# Altium schematic sheet PROC051C_PWR_In_Reference.SchDoc
size 431 x 279 mm; Date: Not shown in title block; ApprovedBy: Not shown in title block; CheckedBy: Not shown in title block; Author: Not shown in title block; CompanyName: Not shown in title block; Engineer: Not shown in title block; Organization: Not shown in title block; Address1: Not shown in title block; Address2: Not shown in title block; Address3: Not shown in title block; Address4: Not shown in title block; DocumentNumber: 4; Revision: Use project parameter SCH_Rev; SheetNumber: 4; SheetTotal: 16; PageSetup: Record=PageOptions|CenterHorizontal=True|CenterVertical=True|PrintScale=1.00|XCorrection=1.00|YCorrection=1.00|PrintKind=0|BorderSize=5000000|LeftOffset=0|BottomOffset=0|Orientation=2|PaperLength=1000|PaperWidth=1000|Scale=100|PaperSource=15|PrintQuality=600|MediaType=1|DitherType=10|PaperKind=Letter|PrintScaleMode=1; CurrentTime: Not shown in title block; CurrentDate: Not shown in title block; Time: Not shown in title block; DocumentFullPathAndName: Not shown in title block; DocumentName: Not shown in title block; ModifiedDate: Not shown in title block; ImagePath: Not shown in title block
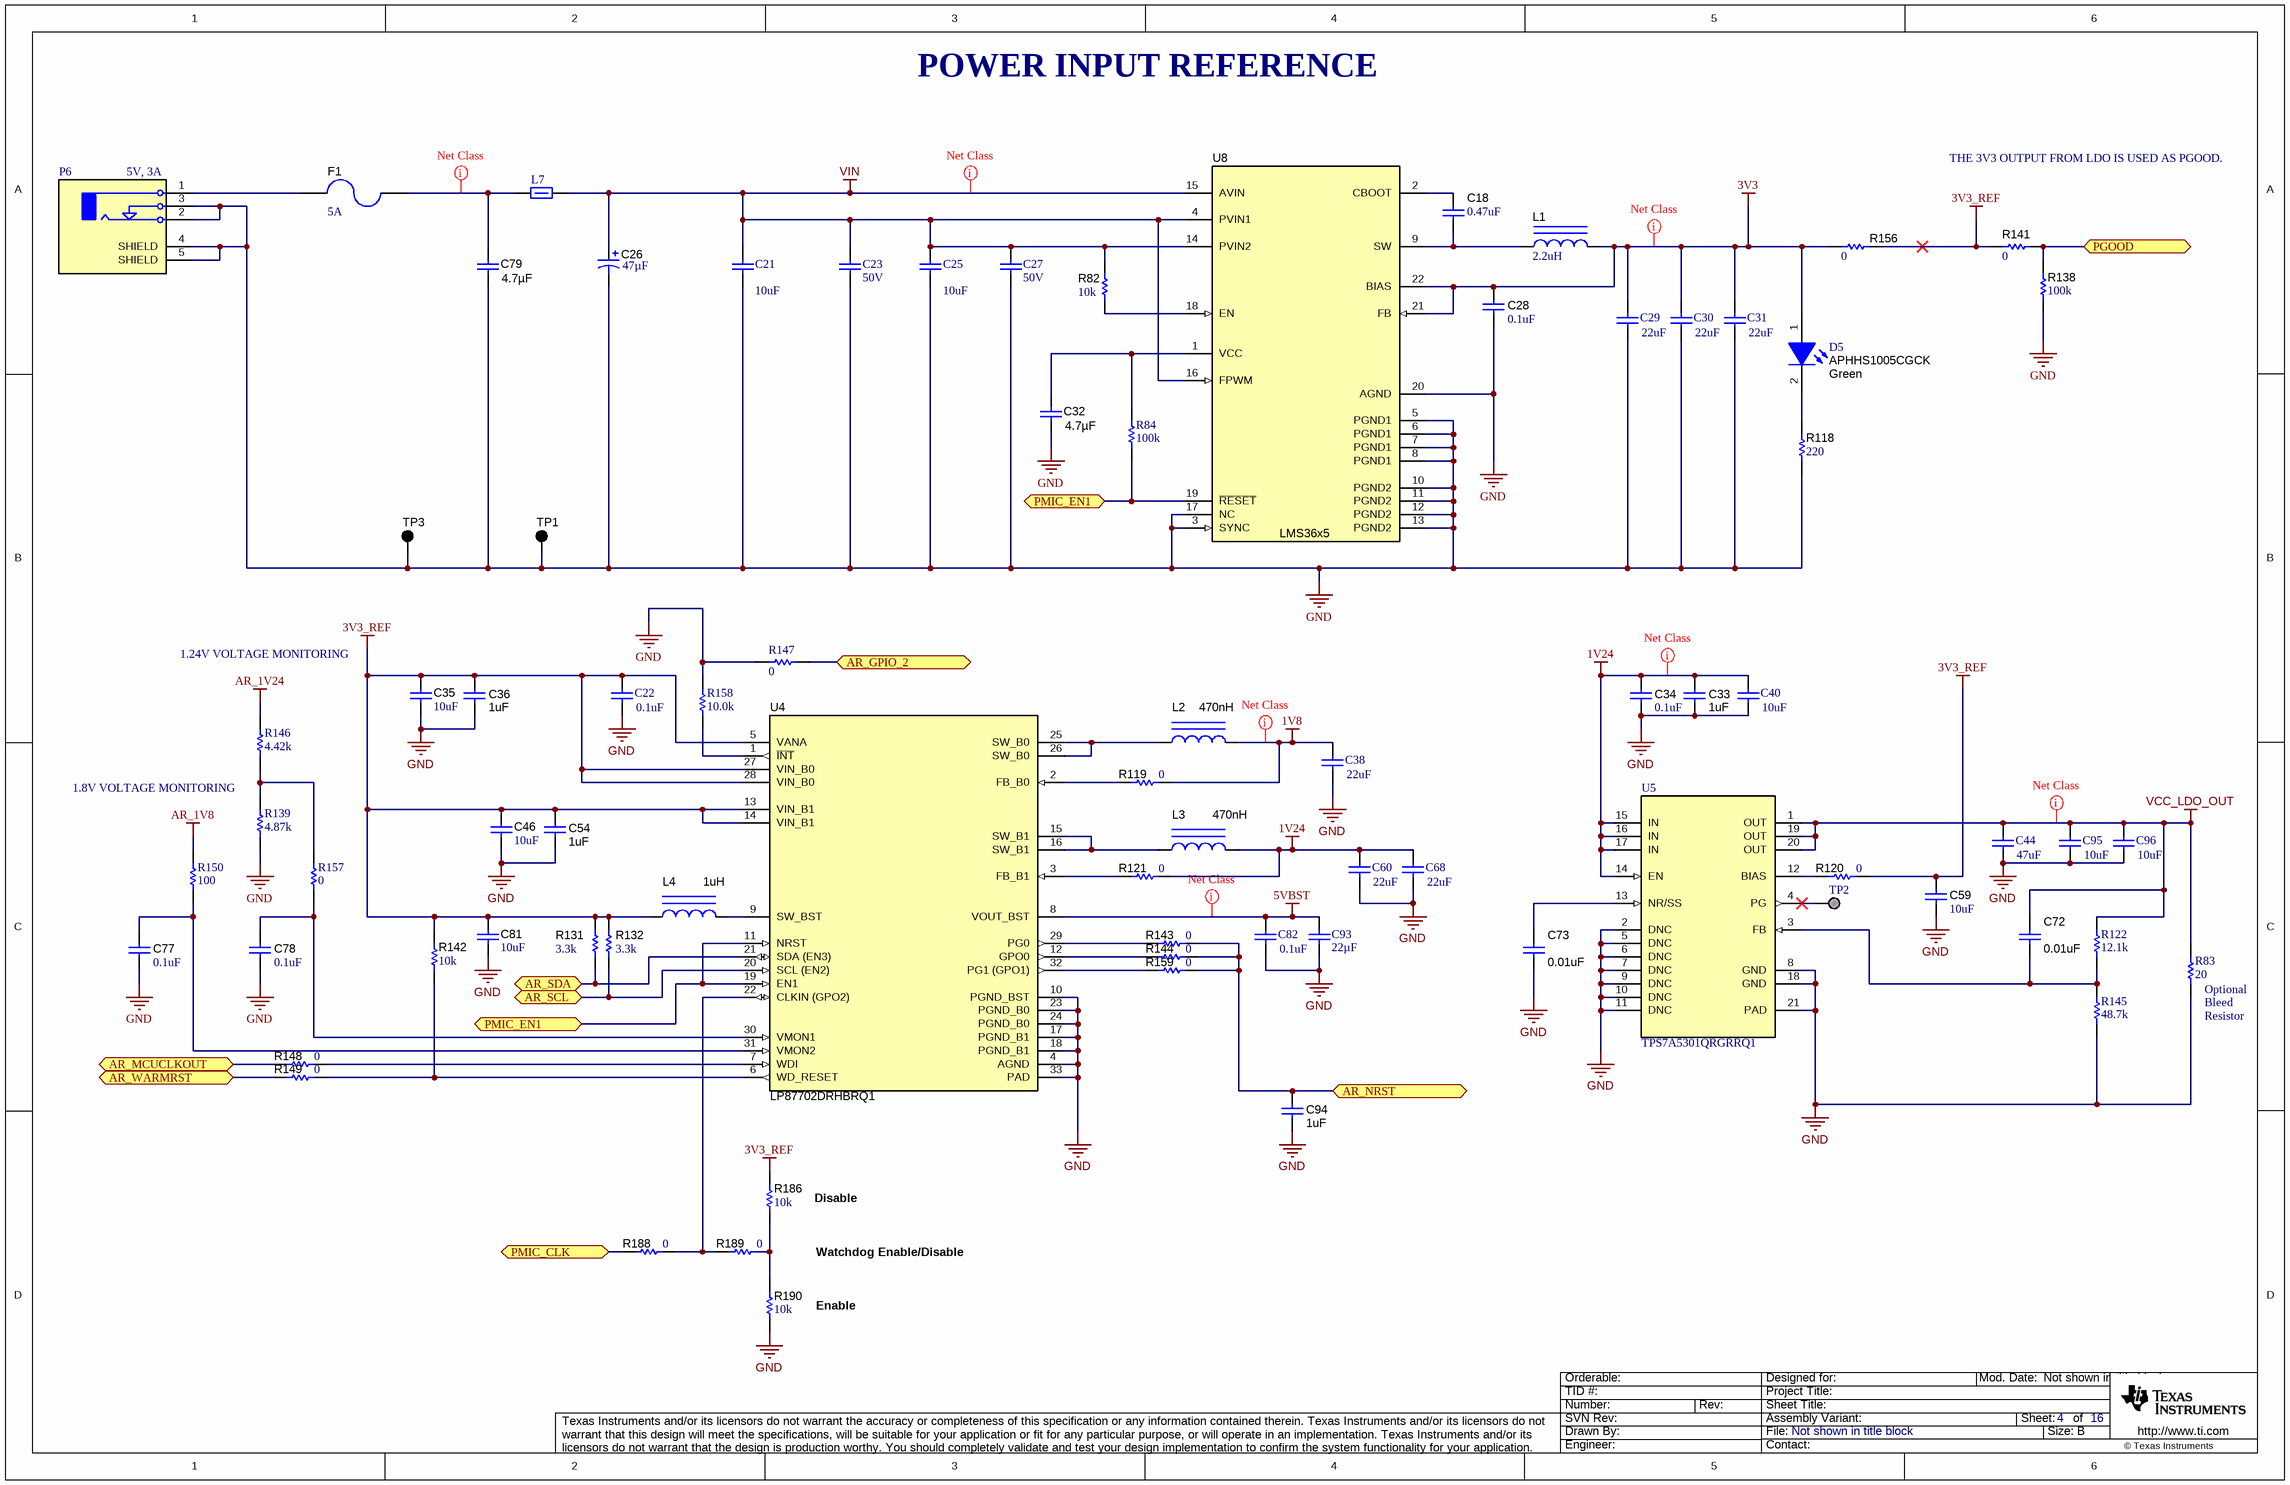
[diagram p0: PROC051C_PWR_In_Reference.SchDoc]

## Parts
C18  ValueDisplayed: 0.47uF  [0402S]  (hidden comment: Capacitor)
C21  ValueDisplayed: 10uF  [1210_280]  (hidden comment: CGA6P1X7R1E106M250AC)
C22  ValueDisplayed: 0.1uF  [0402]  (hidden comment: GCM155R71C104KA55D)
C23  VDC_V: 50V  [0603]  (hidden comment: 06035C473JAT2A)
C25  ValueDisplayed: 10uF  [1210_280]  (hidden comment: CGA6P1X7R1E106M250AC)
C26  ValueDisplayed: 47µF  [3528-21]  (hidden comment: T491B476K010AT)
C27  VDC_V: 50V  [0603]  (hidden comment: 06035C473JAT2A)
C28  ValueDisplayed: 0.1uF  [0402S]  (hidden comment: Capacitor)
C29  ValueDisplayed: 22uF  [1210_280]  (hidden comment: GCM32ER71C226KE19L)
C30  ValueDisplayed: 22uF  [1210_280]  (hidden comment: GCM32ER71C226KE19L)
C31  ValueDisplayed: 22uF  [1210_280]  (hidden comment: GCM32ER71C226KE19L)
C32  ValueDisplayed: 4.7µF  [0805L]  (hidden comment: CGA4J1X7R1E475K125AC)
C33  ValueDisplayed: 1uF  [0603]  (hidden comment: GCM188R71C105KA64D)
C34  ValueDisplayed: 0.1uF  [0402]  (hidden comment: Capacitor)
C35  ValueDisplayed: 10uF  [0805_HV1]  (hidden comment: Capacitor)
C36  ValueDisplayed: 1uF  [0603]  (hidden comment: GCM188R71C105KA64D)
C38  ValueDisplayed: 22uF  [1206_180]  (hidden comment: GCM31CR70J226KE23L)
C40  ValueDisplayed: 10uF  [0805_HV]  (hidden comment: GCM21BR71A106KE22L)
C44  ValueDisplayed: 47uF  [1210_270]  (hidden comment: GCM32ER70J476KE19L)
C46  ValueDisplayed: 10uF  [0805_HV1]  (hidden comment: Capacitor)
C54  ValueDisplayed: 1uF  [0603]  (hidden comment: GCM188R71C105KA64D)
C59  ValueDisplayed: 10uF  [0805_HV]  (hidden comment: Capacitor)
C60  ValueDisplayed: 22uF  [1206_180]  (hidden comment: GCM31CR70J226KE23L)
C68  ValueDisplayed: 22uF  [1206_180]  (hidden comment: GCM31CR70J226KE23L)
C72  ValueDisplayed: 0.01uF  [0402S]  (hidden comment: GCM155R71E103KA37D)
C73  ValueDisplayed: 0.01uF  [0402S]  (hidden comment: GCM155R71E103KA37D)
C77  ValueDisplayed: 0.1uF  [0402]  (hidden comment: Capacitor)
C78  ValueDisplayed: 0.1uF  [0402]  (hidden comment: Capacitor)
C79  ValueDisplayed: 4.7µF  [0805L]  (hidden comment: CGA4J1X7R1E475K125AC)
C81  ValueDisplayed: 10uF  [0805_HV1]  (hidden comment: Capacitor)
C82  ValueDisplayed: 0.1uF  [0402]  (hidden comment: 0402YC104KAT2A)
C93  ValueDisplayed: 22µF  [0805_HV]  (hidden comment: GRT21BR61E226ME13L)
C94  ValueDisplayed: 1uF  [0603]  (hidden comment: GCM188R71C105KA64D)
C95  ValueDisplayed: 10uF  [0805_HV]  (hidden comment: GCM21BR71A106KE22L)
C96  ValueDisplayed: 10uF  [0805_HV]  (hidden comment: GCM21BR71A106KE22L)
D5  APHHS1005CGCK  value Green  [APHHS1005_Green]
F1  0440005.WR  [1206]  (value not drawn)
L1  ValueDisplayed: 2.2uH  [XAL5030]  (hidden comment: XAL5030-222MEB)
L2  ValueDisplayed: 470nH  [DFE252012P]  (hidden comment: DFE252012PD-R47M)
L3  ValueDisplayed: 470nH  [DFE252012P]  (hidden comment: DFE252012PD-R47M)
L4  ValueDisplayed: 1uH  [DFE252012P]  (hidden comment: DFE252012PD-1R0M)
L7  HI2220P601R-10  [2220_345]  (value not drawn)
P6  PJ-051AH  [CUI_PJ-051AH]  (value not drawn)
R82  value 10k  [0402L]  (hidden comment: Resistor)
R83  ValueDisplayed: 20  [0603]  (hidden comment: CRCW060320R0JNEA)
R84  ValueDisplayed: 100k  [0402]  (hidden comment: CRCW0402100KJNED)
R118  ValueDisplayed: 220  [0402]  (hidden comment: CRCW0402220RJNED)
R119  value 0  [0402L]  (hidden comment: Resistor)
R120  value 0  [0402L]  (hidden comment: Resistor)
R121  value 0  [0402L]  (hidden comment: Resistor)
R122  ValueDisplayed: 12.1k  [0402]  (hidden comment: ERA-2AEB1212X)
R131  ValueDisplayed: 3.3k  [0402S]  (hidden comment: Resistor)
R132  ValueDisplayed: 3.3k  [0402S]  (hidden comment: Resistor)
R138  ValueDisplayed: 100k  [0402L]  (hidden comment: CRCW0402100KFKED)
R139  ValueDisplayed: 4.87k  [0402]  (hidden comment: ERA-2AEB4871X)
R141  ValueDisplayed: 0  [0402L]  (hidden comment: ERJ-2GE0R00X)
R142  ValueDisplayed: 10k  [0402]  (hidden comment: CRCW040210K0JNED)
R143  value 0  [0402L]  (hidden comment: Resistor)
R144  value 0  [0402L]  (hidden comment: Resistor)
R145  ValueDisplayed: 48.7k  [0402]  (hidden comment: ERA-2AEB4872X)
R146  ValueDisplayed: 4.42k  [0402]  (hidden comment: ERA-2ARB4421X)
R147  ValueDisplayed: 0  [0402]  (hidden comment: CRCW04020000Z0ED)
R148  value 0  [0402L]  (hidden comment: Resistor)
R149  value 0  [0402L]  (hidden comment: Resistor)
R150  ValueDisplayed: 100  [0402]  (hidden comment: CRCW0402100RFKED)
R156  ValueDisplayed: 0  [2010]  (hidden comment: CRCW20100000Z0EF)
R157  ValueDisplayed: 0  [0402]  (hidden comment: CRCW04020000Z0ED)
R158  ValueDisplayed: 10.0k  [0402]  (hidden comment: CRCW040210K0FKED)
R159  value 0  [0402L]  (hidden comment: Resistor)
R186  ValueDisplayed: 10k  [0402]  (hidden comment: CRCW040210K0JNED)
R188  value 0  [0402L]  (hidden comment: Resistor)
R189  value 0  [0402L]  (hidden comment: Resistor)
R190  ValueDisplayed: 10k  [0402]  (hidden comment: CRCW040210K0JNED)
TP1  5001  [Keystone5001]  (value not drawn)
TP2  TP_H0.45P0.75  [TP_H045P075]  (value not drawn)  (no BOM)
TP3  5001  [Keystone5001]  (value not drawn)
U4  LP87702DRHBRQ1  [RHB0032N]
U5  TPS7A5301QRGRRQ1  [RGR0020A]
U8  LMS36x5  [RNL0022A_NV]

## Ports
AR_GPIO_2, AR_MCUCLKOUT, AR_NRST, AR_SCL, AR_SDA, AR_WARMRST, PGOOD, PMIC_CLK, PMIC_EN1

## Nets
1V8: C38.1 L2.2 R119.1
1V24: C33.2 C34.1 C40.1 C60.1 C68.1 L3.2 R121.1 U5.14(EN) U5.15(IN) U5.16(IN) U5.17(IN)
3V3: C28.1 C29.1 C30.1 C31.1 D5.1(A) L1.2 R156.1 U8.21(FB) U8.22(BIAS)
3V3_REF: C22.1 C35.1 C36.2 C46.1 C54.2 C59.1 C81.1 L4.1 R120.1 R131.2 R132.2 R141.1 R142.2 R156.2 R186.2 U4.5(VANA) U4.13(VIN_B1) U4.14(VIN_B1) U4.27(VIN_B0) U4.28(VIN_B0)
5VBST: C82.1 C93.1 U4.8(VOUT_BST)
AR_1V8: R150.2
AR_1V24: R146.2
GND: C21.2 C22.2 C23.2 C25.2 C26.2(-) C27.2 C28.2 C29.2 C30.2 C31.2 C32.2 C33.1 C34.2 C35.2 C36.1 C38.2 C40.2 C44.2 C46.2 C54.1 C59.2 C60.2 C68.2 C73.2 C77.2 C78.2 C79.2 C81.2 C82.2 C93.2 C94.1 C95.2 C96.2 P6.2(TIP) P6.3(TIP_SWITCH) P6.4(SHIELD) P6.5(SHIELD) R83.1 R118.1 R138.1 R139.1 R145.1 R147.2 R158.2 R190.1 TP1.1 TP3.1 U4.4(AGND) U4.10(PGND_BST) U4.17(PGND_B1) U4.18(PGND_B1) U4.23(PGND_B0) U4.24(PGND_B0) U4.33(PAD) U5.2(DNC) U5.5(DNC) U5.6(DNC) U5.7(DNC) U5.8(GND) U5.9(DNC) U5.10(DNC) U5.11(DNC) U5.18(GND) U5.21(PAD) U8.3(SYNC) U8.5(PGND1) U8.6(PGND1) U8.7(PGND1) U8.8(PGND1) U8.10(PGND2) U8.11(PGND2) U8.12(PGND2) U8.13(PGND2) U8.17(NC) U8.20(AGND)
VCC_LDO_OUT: C44.1 C72.1 C95.1 C96.1 R83.2 R122.2 U5.1(OUT) U5.19(OUT) U5.20(OUT)
VIN: C21.1 C23.1 C25.1 C26.1(+) C27.1 L7.2 R82.1 U8.4(PVIN1) U8.14(PVIN2) U8.15(AVIN) U8.16(FPWM)
AR_GPIO_2: R147.1 ; port AR_GPIO_2
AR_MCUCLKOUT: R148.2 ; port AR_MCUCLKOUT
AR_NRST: C94.2 R143.1 R144.1 R159.1 ; port AR_NRST
AR_SCL: R132.1 U4.20(SCL_(EN2)) ; port AR_SCL
AR_SDA: R131.1 U4.21(SDA_(EN3)) ; port AR_SDA
AR_WARMRST: R149.2 ; port AR_WARMRST
PGOOD: R138.2 R141.2 ; port PGOOD
PMIC_CLK: R188.2 ; port PMIC_CLK
PMIC_EN1: R84.1 U4.11(NRST) U4.19(EN1) U8.19(~{RESET}) ; port PMIC_EN1
NetC18_1: C18.1 U8.2(CBOOT)
NetC18_2: C18.2 L1.1 U8.9(SW)
NetC32_1: C32.1 R84.2 U8.1(VCC)
NetC72_2: C72.2 R122.1 R145.2 U5.3(FB)
NetC73_1: C73.1 U5.13(NR/SS)
NetC77_1: C77.1 R150.1 U4.31(VMON2)
NetC78_1: C78.1 R157.1 U4.30(VMON1)
NetC79_1: C79.1 F1.1 L7.1
NetD5_2: D5.2(K) R118.2
NetF1_2: F1.2 P6.1(SLEEVE)
NetL2_1: L2.1 U4.25(SW_B0) U4.26(SW_B0)
NetL3_1: L3.1 U4.15(SW_B1) U4.16(SW_B1)
NetL4_2: L4.2 U4.9(SW_BST)
NetR82_2: R82.2 U8.18(EN)
NetR119_2: R119.2 U4.2(FB_B0)
NetR120_2: R120.2 U5.12(BIAS)
NetR121_2: R121.2 U4.3(FB_B1)
NetR139_2: R139.2 R146.1 R157.2
NetR142_1: R142.1 R149.1 U4.6(WD_RESET)
NetR143_2: R143.2 U4.29(PG0)
NetR144_2: R144.2 U4.12(GPO0)
NetR148_1: R148.1 U4.7(WDI)
NetR158_1: R158.1 U4.1(~{INT})
NetR159_2: R159.2 U4.32(PG1_(GPO1))
NetR186_1: R186.1 R189.1 R190.2
NetR188_1: R188.1 R189.2 U4.22(CLKIN_(GPO2))
NetTP2_1: TP2.1 U5.4(PG)

## Layout directives
net class Undefined: VCC_LDO_OUT
net class PWR: 1V8, 1V24, 3V3, 5VBST, NetC79_1, VIN

## Notes on the sheet
- POWER INPUT REFERENCE
- THE 3V3 OUTPUT FROM LDO IS USED AS PGOOD.
- (near P6) 5V, 3A
- (near F1) 5A
- 1.24V VOLTAGE MONITORING
- 1.8V VOLTAGE MONITORING
- (near R83) Optional
- (near R83) Bleed
- (near R83) Resistor
- (near R186) Disable
- (near R190) Enable
- Watchdog Enable/Disable
- Drawn By:
- SVN Rev:
- Number:
- TID #:
- Orderable:
- Rev:
- Sheet Title:
- File:
- Project Title:
- Designed for:
- Assembly Variant:
- Mod. Date:
- Sheet:
- Size:
- of
- B
- http://www.ti.com
- Texas Instruments and/or its licensors do not warrant the accuracy or completeness of this specification or any information contained therein. Texas Instruments and/or its licensors do not warrant that this design will meet the specifications, will be suitable for your application or fit for any particular purpose, or will operate in an implementation. Texas Instruments and/or its licensors do not warrant that the design is production worthy. You should completely validate and test your design implementation to confirm the system functionality for your application.
- Engineer:
- Contact:
- © Texas Instruments

## Library data of the parts
C18 = CMP-0006717-2: CAP, CERM, 0.47 uF, 6.3 V, +/- 10%, X7R, 0402; PartNumber: JMK105B7474KVHF; Manufacturer: Taiyo Yuden; Polarized: N; Value: 0.47uF; U/M: EA; Cap_F: 470nF; Value1: Unknown; VDC_V: 6.3V; TaMin_C: -55°C; TaMax_C: 125°C; Cap_Case: 0402; SizeArea_mm2: 0.5; SizeAreaWB_mm2: 3; SizeX_mm: 1; SizeZ_mm: 0.6; AEC Category: Q200; CompType: Capacitor; PackageReference: 0402; RoHS: Y; Tolerance_%: 10%; Value2: 6.3V; MountType: SMT; Technology: Ceramic; TempCo: X7R; SizeY_mm: 0.5; Published: 2008-06-19; Publisher: Texas Instruments; LatestRevisionDate: 2017-03-09; ComponentLink1Description: Datasheet link; ComponentLink1URL: http://ds.yuden.co.jp/TYCOMPAS/ut/detail.do?productNo=JMK105B7474KVHF&fileName=JMK105B7474KVHF_SS&mode=specSheetDownload; Supplier 1: Digi-Key; Supplier Part Number 1: 587-3765-1-ND; Supplier 2: Newark; Supplier Part Number 2: 68X1479; Supplier 3: Mouser; Supplier Part Number 3: 963-JMK105B7474KVHF; AEC Qualified: N; AEC Grade: N/A
C21 C25 = CMP-0009155-2: CAP, CERM, 10 uF, 25 V, +/- 20%, X7R, AEC-Q200 Grade 1, 1210; Manufacturer: TDK; TaMin_C: -55°C; Polarized: N; SizeAreaWB_mm2: 14.7; Value1: Unknown; U/M: EA; Value: 10uF; TaMax_C: 125°C; SizeZ_mm: 2.8; SizeX_mm: 3.2; SizeY_mm: 2.5; Cap_Case: 1210; Value2: 25V; SizeArea_mm2: 8; AEC Qualified: Y; Cap_F: 10µF; AEC Grade: 1; AEC Category: Q200; Supplier Part Number 2: 810-CGA6P1X7R1E106M; Publisher: Texas Instruments; Supplier 2: Mouser; TempCo: X7R; Published: 2008-06-19; RoHS: Y; MountType: SMT; Supplier 1: Digi-Key; PackageReference: 1210; Tolerance_%: 20%; CompType: Capacitor; LatestRevisionDate: 2017-03-09; PartNumber: CGA6P1X7R1E106M250AC; VDC_V: 25V; ComponentLink1Description: Datasheet link; Supplier Part Number 1: 445-5720-1-ND; Technology: Ceramic; ComponentLink1URL: http://product.tdk.com/en/catalog/datasheets/mlcc_automotive_general_en.pdf
C22 = CMP-0006351-2: CAP, CERM, 0.1 uF, 16 V, +/- 10%, X7R, 0402; Manufacturer: MuRata; TaMin_C: -55°C; Polarized: N; SizeAreaWB_mm2: 3; Value1: Unknown; U/M: EA; Value: 0.1uF; TaMax_C: 125°C; SizeZ_mm: 0.6; SizeX_mm: 1; SizeY_mm: 0.5; Value2: 16V; Cap_F: 100nF; AEC Category: Q200; Publisher: Texas Instruments; TempCo: X7R; Published: 2008-06-19; RoHS: Y; MountType: SMT; Supplier 1: Digi-Key; PackageReference: 0402; Tolerance_%: 10%; Cap_Case: 0402; SizeArea_mm2: 0.5; CompType: Capacitor; LatestRevisionDate: 2017-03-09; PartNumber: GCM155R71C104KA55D; AEC Qualified: ?; VDC_V: 16V; ComponentLink1Description: Datasheet link; Supplier Part Number 1: 490-4759-2-ND; Technology: Ceramic; ComponentLink1URL: http://psearch.murata.com/capacitor/product/GCM155R71C104KA55%23.pdf
C23 C27 = CMP-0085252-1: CAP, CERM, 0.047 µF, 50 V,+/- 5%, X7R, 0603; Manufacturer: AVX; Cap_F: 47nF; TaMax_C: 125°C; Value: 0.047uF; SizeX_mm: 1.6; SizeArea_mm2: 1.28; AEC Category: Q200; SizeY_mm: 0.8; Polarized: N; SizeAreaWB_mm2: 4.68; U/M: EA; TaMin_C: -55°C; SizeZ_mm: 1; Tolerance_%: 5%; ComponentLink1URL: http://datasheets.avx.com/X7RDielectric.pdf; Value2: 50V; MountType: SMT; Technology: Ceramic; PartNumber: 06035C473JAT2A; AEC Grade: N/A; ComponentLink1Description: Datasheet link; ValueDisplayed: 0.047µF; Cap_Case: 0603; CompType: Capacitor; PackageReference: 0603; RoHS: Y; TempCo: X7R; AEC Qualified: N
C26 = CMP-0078216-1: CAP, TA, 47 µF, 10 V, +/- 10%, SMD; Manufacturer: Kemet; TaMin_C: -55°C; Polarized: Y; SizeAreaWB_mm2: 17.1; Value: 47uF; TaMax_C: 125°C; SizeZ_mm: 2.1; SizeX_mm: 3.5; SizeY_mm: 2.8; Value2: 10V; SizeArea_mm2: 9.8; CompType: Capacitor; AEC Qualified: N; AEC Category: Q200; ComponentLink1URL: https://content.kemet.com/datasheets/KEM_T2005_T491.pdf; Supplier Part Number 2: 57K1819; Supplier 2: Newark; Supplier Part Number 3: 80-T491B476K010; Supplier 3: Mouser; RoHS: Y; MountType: SMT; Supplier 1: Digi-Key; PackageReference: 3528-21; Tolerance_%: 10%; Cap_Case: 3528-21; PartNumber: T491B476K010AT; Series: T491; Cap_F: 47µF; VDC_V: 10V; ComponentLink1Description: Datasheet link; AEC Grade: N/A; Supplier Part Number 1: 399-9728-1-ND; Technology: TA
C28 = CMP-0006201-2: CAP, CERM, 0.1 uF, 16 V, +/- 10%, X7R, 0402; PartNumber: 0402YC104KAT2A; Manufacturer: AVX; Polarized: N; Value: 0.1uF; U/M: EA; Cap_F: 100nF; Value1: Unknown; VDC_V: 16V; TaMin_C: -55°C; TaMax_C: 125°C; Cap_Case: 0402; SizeArea_mm2: 0.5; SizeAreaWB_mm2: 3; SizeX_mm: 1; SizeZ_mm: 0.6; AEC Category: Q200; CompType: Capacitor; PackageReference: 0402; RoHS: Y; Tolerance_%: 10%; Value2: 16V; MountType: SMT; Technology: Ceramic; TempCo: X7R; SizeY_mm: 0.5; Published: 2008-06-19; Publisher: Texas Instruments; LatestRevisionDate: 2017-03-09; ComponentLink1Description: Datasheet link; ComponentLink1URL: http://catalogs.avx.com/SurfaceMount.pdf; Supplier 1: Digi-Key; Supplier Part Number 1: 478-7888-1-ND; Supplier 2: Newark; Supplier Part Number 2: 09R7024; Supplier 3: Mouser; Supplier Part Number 3: 581-0402YC104KAT2A; AEC Qualified: N; AEC Grade: N/A
C29-C31 = CMP-0009174-2: CAP, CERM, 22 uF, 16 V, +/- 10%, X7R, 1210; Manufacturer: MuRata; TaMin_C: -55°C; Polarized: N; SizeAreaWB_mm2: 14.7; Value1: Unknown; U/M: EA; Value: 22uF; TaMax_C: 125°C; SizeZ_mm: 2.8; SizeX_mm: 3.2; SizeY_mm: 2.5; Cap_Case: 1210; Value2: 16V; SizeArea_mm2: 8; Cap_F: 22µF; AEC Category: Q200; Supplier Part Number 2: 81-GCM32ER71C226K19L; Publisher: Texas Instruments; Supplier 2: Mouser; TempCo: X7R; Published: 2008-06-19; RoHS: Y; MountType: SMT; Supplier 1: Digi-Key; PackageReference: 1210; Tolerance_%: 10%; CompType: Capacitor; LatestRevisionDate: 2017-03-09; PartNumber: GCM32ER71C226KE19L; AEC Qualified: ?; VDC_V: 16V; ComponentLink1Description: Datasheet link; Supplier Part Number 1: 490-5242-1-ND; Technology: Ceramic; ComponentLink1URL: http://www.murata.com/~/media/webrenewal/support/library/catalog/products/capacitor/mlcc/c03e.ashx
C32 C79 = CMP-0076706-1: CAP, CERM, 4.7 µF, 25 V,+/- 10%, X7R, AEC-Q200 Grade 1, 0805; Manufacturer: TDK; SizeAreaWB_mm2: 6.75; SizeArea_mm2: 2.5; AEC Qualified: Y; AEC Category: Q200; Value: 4.7uF; TaMax_C: 125°C; SizeZ_mm: 1.45; AEC Grade: 1; Polarized: N; TaMin_C: -55°C; VDC_V: 25V; SizeY_mm: 1.25; U/M: EA; CompType: Capacitor; SizeX_mm: 2.0; Cap_Case: 2x1.25x1.25mm; ComponentLink1Description: Datasheet link; Cap_F: 4.7µF; RoHS: Y; Supplier Part Number 3: 810-CGA4J1X7R1E475K; Tolerance_%: 10%; Supplier 1: Digi-Key; PackageReference: 0805; Technology: Ceramic; PartNumber: CGA4J1X7R1E475K125AC; Publisher: Texas Instruments; TempCo: X7R; Supplier Part Number 2: 05X9644; Supplier 2: Newark; Published: 2008-06-19; Value2: 25V; LatestRevisionDate: 2017-07-17; ComponentLink1URL: https://product.tdk.com/info/en/catalog/spec/mlccspec_automotive_general_midvoltage_en.pdf; MountType: SMT; Supplier Part Number 1: 445-6967-1-ND; Supplier 3: Mouser
C33 C36 C54 C94 = CMP-0007136-5: CAP, CERM, 1 uF, 16 V, +/- 10%, X7R, AEC-Q200 Grade 1, 0603; Manufacturer: MuRata; TaMin_C: -55°C; Polarized: N; SizeAreaWB_mm2: 4.68; Value1: Unknown; U/M: EA; Value: 1uF; TaMax_C: 125°C; SizeZ_mm: 1; SizeX_mm: 1.6; SizeY_mm: 0.8; Value2: 16V; SizeArea_mm2: 1.28; AEC Qualified: Y; Cap_F: 1µF; AEC Category: Q200; Supplier Part Number 2: 81-GCM188R71C105K64D; Publisher: Texas Instruments; Supplier 2: Mouser; TempCo: X7R; Published: 2008-06-19; RoHS: Y; MountType: SMT; Supplier 1: Digi-Key; PackageReference: 0603; Tolerance_%: 10%; Cap_Case: 0603; CompType: Capacitor; LatestRevisionDate: 2017-03-09; PartNumber: GCM188R71C105KA64D; VDC_V: 16V; ComponentLink1Description: Datasheet link; AEC Grade: 1; Supplier Part Number 1: 490-5241-6-ND; Technology: Ceramic; ComponentLink1URL: http://psearch.en.murata.com/capacitor/product/GCM188R71C105KA64%23.pdf
C34 C77 C78 = CMP-0006201-2: CAP, CERM, 0.1 uF, 16 V, +/- 10%, X7R, 0402; PartNumber: 0402YC104KAT2A; Manufacturer: AVX; Polarized: N; Value: 0.1uF; U/M: EA; Cap_F: 100nF; Value1: Unknown; VDC_V: 16V; TaMin_C: -55°C; TaMax_C: 125°C; SizeArea_mm2: 0.5; SizeAreaWB_mm2: 3; SizeX_mm: 1; SizeZ_mm: 0.6; AEC Category: Q200; CompType: Capacitor; PackageReference: 0402; RoHS: Y; Tolerance_%: 10%; Value2: 16V; MountType: SMT; Technology: Ceramic; TempCo: X7R; Cap_Case: 0402; SizeY_mm: 0.5; Published: 2008-06-19; Publisher: Texas Instruments; LatestRevisionDate: 2017-03-09; ComponentLink1Description: Datasheet link; ComponentLink1URL: http://catalogs.avx.com/SurfaceMount.pdf; Supplier 1: Digi-Key; Supplier Part Number 1: 478-7888-1-ND; Supplier 2: Newark; Supplier Part Number 2: 09R7024; Supplier 3: Mouser; Supplier Part Number 3: 581-0402YC104KAT2A; AEC Qualified: N; AEC Grade: N/A
C35 C46 C81 = CMP-0007995-2: CAP, CERM, 10 uF, 16 V, +/- 10%, X7R, 0805; PartNumber: CL21B106KOQNNNE; Manufacturer: Samsung Electro-Mechanics; Polarized: N; Value: 10uF; U/M: EA; Cap_F: 10µF; Value1: Unknown; VDC_V: 16V; TaMin_C: -55°C; TaMax_C: 125°C; Cap_Case: 0805; SizeArea_mm2: 2.5; SizeAreaWB_mm2: 6.75; SizeX_mm: 2; SizeY_mm: 1.25; SizeZ_mm: 1.45; AEC Category: Q200; CompType: Capacitor; PackageReference: 0805; RoHS: Y; Tolerance_%: 10%; Value2: 16V; MountType: SMT; Technology: Ceramic; TempCo: X7R; Published: 2008-06-19; Publisher: Texas Instruments; LatestRevisionDate: 2017-03-09; ComponentLink1Description: Datasheet link; ComponentLink1URL: http://www.samsungsem.com/servlet/FileDownload?type=spec&file=CL21B106KOQNNNE.pdf; AEC Qualified: ?
C38 C60 = CMP-0008809-2: CAP, CERM, 22 uF, 6.3 V, +/- 10%, X7R, AEC-Q200 Grade 1, 1206; Manufacturer: MuRata; TaMin_C: -55°C; Polarized: N; SizeAreaWB_mm2: 10.92; Value1: Unknown; U/M: EA; Value: 22uF; TaMax_C: 125°C; SizeZ_mm: 1.8; SizeX_mm: 3.2; SizeY_mm: 1.6; Cap_Case: 1206; Value2: 6.3V; SizeArea_mm2: 5.12; AEC Qualified: Y; Cap_F: 22µF; AEC Grade: 1; AEC Category: Q200; Supplier Part Number 2: 81-GCM31CR70J226KE3L; Publisher: Texas Instruments; Supplier 2: Mouser; TempCo: X7R; Published: 2008-06-19; RoHS: Y; MountType: SMT; Supplier 1: Digi-Key; PackageReference: 1206; Tolerance_%: 10%; CompType: Capacitor; LatestRevisionDate: 2017-03-09; PartNumber: GCM31CR70J226KE23L; VDC_V: 6.3V; ComponentLink1Description: Datasheet link; Supplier Part Number 1: 490-4843-1-ND; Technology: Ceramic; ComponentLink1URL: http://psearch.en.murata.com/capacitor/product/GCM31CR70J226KE23%23.pdf
C40 C95 C96 = CMP-0008017-2: CAP, CERM, 10 uF, 10 V, +/- 10%, X7R, 0805; Manufacturer: MuRata; TaMin_C: -55°C; Polarized: N; SizeAreaWB_mm2: 6.75; Value1: Unknown; U/M: EA; Value: 10uF; TaMax_C: 125°C; SizeZ_mm: 1.45; SizeX_mm: 2; SizeY_mm: 1.25; Cap_Case: 0805; Value2: 10V; SizeArea_mm2: 2.5; Cap_F: 10µF; AEC Category: Q200; Supplier Part Number 2: 06AC6014; Publisher: Texas Instruments; Supplier 2: Newark; Supplier Part Number 3: 81-GCM21BR71A106KE2L; TempCo: X7R; Supplier 3: Mouser; Published: 2008-06-19; RoHS: Y; MountType: SMT; Supplier 1: Digi-Key; PackageReference: 0805; Tolerance_%: 10%; CompType: Capacitor; LatestRevisionDate: 2017-03-09; PartNumber: GCM21BR71A106KE22L; AEC Qualified: ?; VDC_V: 10V; ComponentLink1Description: Datasheet link; Supplier Part Number 1: 490-10674-1-ND; Technology: Ceramic; ComponentLink1URL: http://www.murata.com/products/catalog/pdf/c03e.pdf
C44 = CMP-0009172-2: CAP, CERM, 47 uF, 6.3 V, +/- 10%, X7R, AEC-Q200 Grade 1, 1210; Manufacturer: MuRata; TaMin_C: -55°C; Polarized: N; SizeAreaWB_mm2: 14.7; Value1: Unknown; U/M: EA; Value: 47uF; TaMax_C: 125°C; SizeZ_mm: 2.7; SizeX_mm: 3.2; SizeY_mm: 2.5; Cap_Case: 1210; Value2: 6.3V; SizeArea_mm2: 8; AEC Qualified: Y; Cap_F: 47µF; AEC Grade: 1; AEC Category: Q200; Supplier Part Number 2: 06AC6022; Publisher: Texas Instruments; Supplier 2: Newark; Supplier Part Number 3: 81-GCM32ER70J476KE9L; TempCo: X7R; Supplier 3: Mouser; Published: 2008-06-19; RoHS: Y; MountType: SMT; Supplier 1: Digi-Key; PackageReference: 1210; Tolerance_%: 10%; CompType: Capacitor; LatestRevisionDate: 2017-03-09; PartNumber: GCM32ER70J476KE19L; VDC_V: 6.3V; ComponentLink1Description: Datasheet link; Supplier Part Number 1: 490-4844-1-ND; Technology: Ceramic; ComponentLink1URL: http://search.murata.co.jp/Ceramy/image/img/A01X/G101/ENG/GCM32ER70J476KE19-01.pdf
C59 = CMP-0008017-2: CAP, CERM, 10 uF, 10 V, +/- 10%, X7R, 0805; PartNumber: GCM21BR71A106KE22L; Manufacturer: MuRata; Polarized: N; Value: 10uF; U/M: EA; Cap_F: 10µF; Value1: Unknown; VDC_V: 10V; TaMin_C: -55°C; TaMax_C: 125°C; Cap_Case: 0805; SizeArea_mm2: 2.5; SizeAreaWB_mm2: 6.75; SizeX_mm: 2; SizeY_mm: 1.25; SizeZ_mm: 1.45; AEC Category: Q200; CompType: Capacitor; PackageReference: 0805; RoHS: Y; Tolerance_%: 10%; Value2: 10V; MountType: SMT; Technology: Ceramic; TempCo: X7R; Published: 2008-06-19; Publisher: Texas Instruments; LatestRevisionDate: 2017-03-09; ComponentLink1Description: Datasheet link; ComponentLink1URL: http://www.murata.com/products/catalog/pdf/c03e.pdf; Supplier 1: Digi-Key; Supplier Part Number 1: 490-10674-1-ND; Supplier 2: Newark; Supplier Part Number 2: 06AC6014; Supplier 3: Mouser; Supplier Part Number 3: 81-GCM21BR71A106KE2L; AEC Qualified: ?
C68 = CMP-0008809-2: CAP, CERM, 22 uF, 6.3 V, +/- 10%, X7R, AEC-Q200 Grade 1, 1206; Manufacturer: MuRata; TaMin_C: -55°C; Polarized: N; SizeAreaWB_mm2: 10.92; Value1: Unknown; U/M: EA; Value: 22uF; TaMax_C: 125°C; SizeZ_mm: 1.8; SizeX_mm: 3.2; SizeY_mm: 1.6; Cap_Case: 1206; Value2: 6.3V; SizeArea_mm2: 5.12; CompType: Capacitor; AEC Qualified: Y; Cap_F: 22µF; AEC Grade: 1; AEC Category: Q200; Supplier Part Number 2: 81-GCM31CR70J226KE3L; Publisher: Texas Instruments; Supplier 2: Mouser; TempCo: X7R; Published: 2008-06-19; RoHS: Y; MountType: SMT; Supplier 1: Digi-Key; PackageReference: 1206; Tolerance_%: 10%; LatestRevisionDate: 2017-03-09; PartNumber: GCM31CR70J226KE23L; VDC_V: 6.3V; ComponentLink1Description: Datasheet link; Supplier Part Number 1: 490-4843-1-ND; Technology: Ceramic; ComponentLink1URL: http://psearch.en.murata.com/capacitor/product/GCM31CR70J226KE23%23.pdf
C72 C73 = CMP-0006352-2: CAP, CERM, 0.01 uF, 25 V, +/- 10%, X7R, 0402; Manufacturer: MuRata; TaMin_C: -55°C; Polarized: N; SizeAreaWB_mm2: 3; Value1: Unknown; U/M: EA; Value: 0.01uF; TaMax_C: 125°C; SizeZ_mm: 0.6; SizeX_mm: 1; SizeY_mm: 0.5; Cap_Case: 0402; Value2: 25V; CompType: Capacitor; Cap_F: 10nF; AEC Category: Q200; Publisher: Texas Instruments; TempCo: X7R; Published: 2008-06-19; RoHS: Y; MountType: SMT; Supplier 1: Digi-Key; PackageReference: 0402; Tolerance_%: 10%; SizeArea_mm2: 0.5; LatestRevisionDate: 2017-03-09; PartNumber: GCM155R71E103KA37D; AEC Qualified: ?; VDC_V: 25V; ComponentLink1Description: Datasheet link; Supplier Part Number 1: 490-6043-2-ND; Technology: Ceramic; ComponentLink1URL: http://psearch.murata.com/capacitor/product/GCM155R71E103KA37%23.pdf
C82 = CMP-0006201-2: CAP, CERM, 0.1 uF, 16 V, +/- 10%, X7R, 0402; Manufacturer: AVX; TaMin_C: -55°C; Polarized: N; SizeAreaWB_mm2: 3; Value1: Unknown; U/M: EA; Value: 0.1uF; TaMax_C: 125°C; SizeZ_mm: 0.6; SizeX_mm: 1; SizeY_mm: 0.5; Value2: 16V; Cap_F: 100nF; AEC Category: Q200; Supplier Part Number 2: 09R7024; Publisher: Texas Instruments; Supplier 2: Newark; Supplier Part Number 3: 581-0402YC104KAT2A; TempCo: X7R; Supplier 3: Mouser; Published: 2008-06-19; RoHS: Y; MountType: SMT; Supplier 1: Digi-Key; PackageReference: 0402; Tolerance_%: 10%; Cap_Case: 0402; SizeArea_mm2: 0.5; CompType: Capacitor; LatestRevisionDate: 2017-03-09; PartNumber: 0402YC104KAT2A; AEC Qualified: N; VDC_V: 16V; ComponentLink1Description: Datasheet link; AEC Grade: N/A; Supplier Part Number 1: 478-7888-1-ND; Technology: Ceramic; ComponentLink1URL: http://catalogs.avx.com/SurfaceMount.pdf
C93 = CMP-0084680-1: CAP, CERM, 22 µF, 25 V,+/- 20%, X5R, AEC-Q200 Grade 3, 0805; Manufacturer: MuRata; SizeX_mm: 2; SizeAreaWB_mm2: 6.75; Cap_Case: 0805; AEC Grade: 3; SizeY_mm: 1.25; SizeArea_mm2: 2.5; SizeZ_mm: 1.45; U/M: EA; Polarized: N; VDC_V: 25V; AEC Category: Q200; Value: 22uF; TaMin_C: -55°C; AEC Qualified: Y; TaMax_C: 85°C; TempCo: X5R; ComponentLink1URL: https://search.murata.co.jp/Ceramy/image/img/A01X/G101/ENG/GRT21BR61E226ME13-01.pdf; ComponentLink1Description: Datasheet link; PartNumber: GRT21BR61E226ME13L; MountType: SMT; RoHS: Y; Cap_F: 22µF; Tolerance_%: 20%; PackageReference: 0805; CompType: Capacitor; Value2: 25V; Technology: Ceramic
D5 = CMP-0067682-2: LED, Green, SMD; Manufacturer: Kingbright; Io_A: 20mA; Power_TotalModule: 75mW; SizeAreaWB_mm2: 3.0; Vr_V: 5V; Tjmax_C: 85°C; Value1: 0.075W; Angle: 120.0; SizeZ_mm: 0.6; SizeX_mm: 1.0; SizeY_mm: 0.5; Ir_A: 10µA; Vf_V: 2.1V; ComponentLink1URL: http://www.kingbrightusa.com/images/catalog/SPEC/APHHS1005CGCK.pdf; Color: Green; RoHS: Y; MountType: SMT; PackageReference: 0402; Value2: 2.1V; SizeArea_mm2: 0.5; CompType: LED; Type: ?; PartNumber: APHHS1005CGCK; ComponentLink1Description: Datasheet link
F1 = CMP-0003458-2: Fuse, 5 A, 32VAC/VDC, SMD; Manufacturer: Littelfuse; Irating_A: 5A; SizeAreaWB_mm2: 10.92; Interrupt_AC: 50A; VAC_V: 32V; SizeZ_mm: 1.35; SizeX_mm: 3.2; SizeY_mm: 1.6; SizeArea_mm2: 5.12; Rtyp_Ohm: 0.012; MeltingTyp: 4.761; ComponentLink1URL: http://www.littelfuse.com/~/media/electronics/datasheets/fuses/littelfuse_fuse_440_datasheet.pdf.pdf; Supplier Part Number 2: 64R8013; Supplier 2: Newark; Supplier Part Number 3: 576-0440005.WR; Supplier 3: Mouser; RoHS: Y; MountType: SMT; Interrupt_DC: 50A; Supplier 1: Digi-Key; PackageReference: 1206; CompType: Fuse; PartNumber: 0440005.WR; VDC_V: 32V; ComponentLink1Description: Datasheet URL; Supplier Part Number 1: F1608CT-ND
L1 = CMP-0061001-2: Inductor, Shielded, Composite, 2.2 µH, 9.2 A, 0.01 ohm, AEC-Q200 Grade 1, SMD; Manufacturer: Coilcraft; Isat: 12.9A @ 30% inductance drop; Irms: 9.2A @ 40C rise; Green_Lifecycle: Not Set; SizeAreaWB_mm2: 54.4544; DCR_ohm: 0.01; Green_REACh: Incomplete; Value: 2.2uH; Imax_A: 9.2A; SizeZ_mm: 3.1; SizeX_mm: 5.28; SizeY_mm: 5.48; SizeArea_mm2: 28.9344; Ind_H: 2.2µH; AEC Qualified: 1; AEC Category: Q200; AEC Grade: Y; ComponentLink1URL: http://www.coilcraft.com/pdfs/XAL50xx_.pdf; RoHS: Y; Value1: 0.01 ohm; Material: Composite; MountType: SMT; Green_EU RoHS-2: Incomplete; Green_EU RoHS: Incomplete; PackageReference: 5.3x31.x5.5mm; Value2: 9.2A; CompType: Inductor; PartNumber: XAL5030-222MEB; ComponentLink1Description: Datasheet link; Technology: Shielded
L2 L3 = CMP-0058944-1: Inductor, Shielded, 470 nH, 4.7 A, 0.021 ohm, SMD; Manufacturer: MuRata Toko; Isat: 6.1A @ 30% inductance drop; Irms: 4.7A @ 40C rise; SizeAreaWB_mm2: 10.5; DCR_ohm: 0.021; Value: 470nH; Imax_A: 4.7A; SizeZ_mm: 1.2; SizeX_mm: 2.5; SizeY_mm: 2; SizeArea_mm2: 5; AEC Category: Q200; ComponentLink1URL: https://sps06.itg.ti.com/sites/KMS/crossdivteams/altium/docs/ComponentDatasheets/DFE252012PD_Catalouge_20140701 with AEC-Q200.pdf; Publisher: Texas Instruments; Published: 2008-06-26; RoHS: Y; Value1: 0.021 ohm; Material: ?; MountType: SMT; PackageReference: 1008; Value2: 4.7A; CompType: Inductor; Ind_H: 470nH; LatestRevisionDate: 2017-06-02; PartNumber: DFE252012PD-R47M; AEC Qualified: ?; ComponentLink1Description: Datasheet link; Technology: Shielded
L4 = CMP-0058938-1: Inductor, Shielded, 1 uH, 3.8 A, 0.035 ohm, AEC-Q200 Grade 1, SMD; Manufacturer: MuRata Toko; Isat: 4.5A @ 30% inductance drop; Irms: 3.8A @ 40C rise; SizeAreaWB_mm2: 10.5; DCR_ohm: 0.035; Value: 1uH; Imax_A: 3.8A; SizeZ_mm: 1.2; SizeX_mm: 2.5; SizeY_mm: 2; SizeArea_mm2: 5; Ind_H: 1µH; AEC Qualified: Y; AEC Grade: 1; AEC Category: Q200; ComponentLink1URL: https://sps06.itg.ti.com/sites/KMS/crossdivteams/altium/docs/ComponentDatasheets/DFE252012PD_Catalouge_20140701 with AEC-Q200.pdf; Publisher: Texas Instruments; Published: 2008-06-26; RoHS: Y; Value1: 0.035 ohm; Material: ?; MountType: SMT; PackageReference: 1008; Value2: 3.8A; CompType: Inductor; LatestRevisionDate: 2017-06-02; PartNumber: DFE252012PD-1R0M; ComponentLink1Description: Datasheet link; Technology: Shielded
L7 = CMP-0003388-1: Ferrite Bead, 600 ohm @ 100 MHz, 4 A, 2220; Manufacturer: Laird-Signal Integrity Products; Ztyp@1GHz_Ohm: 106; ZTyp@100MHz_Ohm: 600; SizeAreaWB_mm2: 53.96; DCR_ohm: 0.025; Value1: 0.025 ohm; Value: 600 ohm; Imax_A: 4A; SizeZ_mm: 3.45; SizeX_mm: 5.6; SizeY_mm: 5.1; SizeArea_mm2: 28.56; ComponentLink1URL: https://assets.lairdtech.com/home/brandworld/files/HI2220P601R-10.pdf; Supplier Part Number 2: 875-HI2220P601R-10; Publisher: Texas Instruments; Supplier 2: Mouser; Published: 2014-04-30; RoHS: Y; MountType: SMT; Supplier 1: Digi-Key; PackageReference: 2220; Value2: 4A; CompType: Ferrite Bead; LatestRevisionDate: 2017-03-09; PartNumber: HI2220P601R-10; ComponentLink1Description: Datasheet link; Supplier Part Number 1: 240-2427-1-ND; ValueDisplayed: 600 ohm
P6 = CMP-0081851-1: DC Power Jack, R/A, TH; Manufacturer: CUI Inc.; Gender: Male; Cert_UL: Y; Current_A: 5A; Voltage_V: 24V; ComponentLink1Description: Datasheet URL; RoHS: Y; Supplier 1: Digi-Key; Orientation: R/A; PackageReference: DC Power Jack, R/A, TH; Color: Black; PartNumber: PJ-051AH; PinCount: 3; Supplier Part Number 2: 490-PJ-051AH; Supplier 2: Mouser; ComponentLink1URL: https://www.cui.com/product/resource/pj-051ah.pdf; CompType: Jack; Supplier Part Number 1: CP-051AH-ND; MountType: TH
R82 = CMP-0026825-5: RES, 10 k, 5%, 0.063 W, AEC-Q200 Grade 0, 0402; PartNumber: CRCW040210K0JNED; Manufacturer: Vishay-Dale; Value_Code: 10k0; Power_W: 63mW; Value2: 0.063W; VDC_V: 50V; TempCo: 200 ppm/C; EIA_Code: E24; AEC Category: Q200; AEC Grade: 0; AEC Qualified: Y; SizeArea_mm2: 0.5; SizeX_mm: 1; SizeZ_mm: 0.6; CompType: Resistor; PackageReference: 0402; RoHS: E; Res_ohm: 10k; Tolerance_%: 5%; Value1: 5%; MountType: SMT; Technology: Thick Film; ComponentLink1Description: Datasheet link; ComponentLink1URL: http://www.vishay.com/docs/20035/dcrcwe3.pdf; Supplier 1: Digi-Key; Supplier Part Number 1: 541-10KJCT-ND; Supplier 2: Newark; Supplier Part Number 2: 59M6696; Supplier 3: Mouser; Supplier Part Number 3: 71-CRCW0402J-10K-E3; SizeY_mm: 0.5; ValueDisplayed: 10k
R83 = CMP-0025754-4: RES, 20, 5%, 0.1 W, AEC-Q200 Grade 0, 0603; Manufacturer: Vishay-Dale; Power_W: 100mW; TempCo: 200 ppm/C; Value_Code: 20R0; Value: 20; EIA_Code: E24; SizeX_mm: 1.6; SizeY_mm: 0.8; SizeZ_mm: 1; Value2: 0.1W; SizeArea_mm2: 1.28; AEC Qualified: Y; VDC_V: 75V; AEC Category: Q200; AEC Grade: 0; Supplier Part Number 2: 59M6784; Supplier 2: Newark; Supplier Part Number 3: 71-CRCW0603J-20-E3; Supplier 3: Mouser; RoHS: E; Value1: 5%; MountType: SMT; Supplier 1: Digi-Key; PackageReference: 0603; Tolerance_%: 5%; Res_ohm: 20; CompType: Resistor; PartNumber: CRCW060320R0JNEA; ComponentLink1Description: Datasheet link; Supplier Part Number 1: 541-20GCT-ND; Technology: Thick Film; ComponentLink1URL: http://www.vishay.com/docs/20035/dcrcwe3.pdf
R84 = CMP-0026823-3: RES, 100 k, 5%, 0.063 W, AEC-Q200 Grade 0, 0402; Manufacturer: Vishay-Dale; Power_W: 63mW; TempCo: 200 ppm/C; Value: 100k; EIA_Code: E24; SizeX_mm: 1; SizeY_mm: 0.5; SizeZ_mm: 0.6; Value2: 0.063W; AEC Qualified: Y; VDC_V: 50V; AEC Category: Q200; AEC Grade: 0; Supplier Part Number 2: 59M6699; Supplier 2: Newark; Supplier Part Number 3: 71-CRCW0402J-100K-E3; Supplier 3: Mouser; Value_Code: 100k; RoHS: E; Value1: 5%; MountType: SMT; Supplier 1: Digi-Key; PackageReference: 0402; Tolerance_%: 5%; Res_ohm: 100k; SizeArea_mm2: 0.5; CompType: Resistor; PartNumber: CRCW0402100KJNED; ComponentLink1Description: Datasheet link; Supplier Part Number 1: 541-100KJCT-ND; Technology: Thick Film; ComponentLink1URL: http://www.vishay.com/docs/20035/dcrcwe3.pdf
R118 = CMP-0026878-3: RES, 220, 5%, 0.063 W, AEC-Q200 Grade 0, 0402; Manufacturer: Vishay-Dale; Power_W: 63mW; TempCo: 200 ppm/C; Value_Code: 220R; Value: 220; EIA_Code: E24; SizeX_mm: 1; SizeY_mm: 0.5; SizeZ_mm: 0.6; Value2: 0.063W; AEC Qualified: Y; VDC_V: 50V; AEC Category: Q200; AEC Grade: 0; Supplier Part Number 2: 59M6718; Supplier 2: Newark; Supplier Part Number 3: 71-CRCW0402J-220-E3; Supplier 3: Mouser; RoHS: E; Value1: 5%; MountType: SMT; Supplier 1: Digi-Key; PackageReference: 0402; Tolerance_%: 5%; Res_ohm: 220; SizeArea_mm2: 0.5; CompType: Resistor; PartNumber: CRCW0402220RJNED; ComponentLink1Description: Datasheet link; Supplier Part Number 1: 541-220JCT-ND; Technology: Thick Film; ComponentLink1URL: http://www.vishay.com/docs/20035/dcrcwe3.pdf
R119-R121 R143 R144 R148 R149 R159 R188 R189 = CMP-0026822-3: RES, 0, 5%, 0.063 W, AEC-Q200 Grade 0, 0402; PartNumber: CRCW04020000Z0ED; Manufacturer: Vishay-Dale; Value_Code: 0000; Power_W: 63mW; Value2: 0.063W; VDC_V: 50V; TempCo: 200 ppm/C; EIA_Code: E24; AEC Category: Q200; AEC Qualified: Y; SizeArea_mm2: 0.5; SizeX_mm: 1; SizeZ_mm: 0.6; CompType: Resistor; PackageReference: 0402; RoHS: E; Res_ohm: 0; Tolerance_%: 5%; Value1: 5%; MountType: SMT; Technology: Thick Film; ComponentLink1Description: Datasheet link; ComponentLink1URL: http://www.vishay.com/docs/20035/dcrcwe3.pdf; Supplier 1: Digi-Key; Supplier Part Number 1: 541-0.0JCT-ND; Supplier 2: Newark; Supplier Part Number 2: 52K6543; Supplier 3: Mouser; Supplier Part Number 3: 71-CRCW0402-0-E3; AEC Grade: 0; SizeY_mm: 0.5; ValueDisplayed: 0
R122 = CMP-0083631-1: RES, 12.1 k, 0.1%, 0.063 W, AEC-Q200 Grade 0, 0402; Manufacturer: Panasonic; Power_W: 63mW; TempCo: 25 ppm/C; SizeAreaWB_mm2: 3; Value_Code: 12k1; Value: 12.1k; EIA_Code: E192; SizeX_mm: 1; SizeY_mm: 0.5; SizeZ_mm: 0.6; Value2: 0.063W; CompType: Resistor; AEC Qualified: Y; VDC_V: 50V; AEC Grade: 0; AEC Category: Q200; ComponentLink1URL: https://industrial.panasonic.com/cdbs/www-data/pdf/RDM0000/AOA0000C307.pdf; Supplier Part Number 2: 85Y5323; Supplier 2: Newark; Supplier Part Number 3: 667-ERA-2AEB1212X; Supplier 3: Mouser; RoHS: Y; Value1: 0.1%; MountType: SMT; Supplier 1: Digi-Key; PackageReference: 0402; Tolerance_%: 0.1%; Res_ohm: 12.1k; SizeArea_mm2: 0.5; PartNumber: ERA-2AEB1212X; ComponentLink1Description: Datasheet link; Supplier Part Number 1: P12.1KDCCT-ND; Technology: Thin Film
R131 R132 = CMP-0026918-5: RES, 3.3 k, 5%, 0.063 W, AEC-Q200 Grade 0, 0402; PartNumber: CRCW04023K30JNED; Manufacturer: Vishay-Dale; Value: 3.3k; Value_Code: 3k30; Power_W: 63mW; Value2: 0.063W; VDC_V: 50V; TempCo: 200 ppm/C; SizeArea_mm2: 0.5; SizeX_mm: 1; SizeZ_mm: 0.6; EIA_Code: E24; AEC Category: Q200; AEC Qualified: Y; AEC Grade: 0; CompType: Resistor; PackageReference: 0402; RoHS: E; Res_ohm: 3.3k; Tolerance_%: 5%; Value1: 5%; MountType: SMT; Technology: Thick Film; SizeY_mm: 0.5; ComponentLink1Description: Datasheet link; ComponentLink1URL: http://www.vishay.com/docs/20035/dcrcwe3.pdf; Supplier 1: Digi-Key; Supplier Part Number 1: 541-3.3KJCT-ND; Supplier 2: Newark; Supplier Part Number 2: 59M6723; Supplier 3: Mouser; Supplier Part Number 3: 71-CRCW0402J-3.3K-E3
R138 = CMP-0025950-3: RES, 100 k, 1%, 0.063 W, AEC-Q200 Grade 0, 0402; Manufacturer: Vishay-Dale; Power_W: 63mW; TempCo: 100 ppm/C; Value: 100k; EIA_Code: E96; SizeX_mm: 1; SizeY_mm: 0.5; SizeZ_mm: 0.6; Value2: 0.063W; AEC Qualified: Y; VDC_V: 50V; AEC Category: Q200; AEC Grade: 0; Supplier Part Number 2: 52K6607; Supplier 2: Newark; Supplier Part Number 3: 71-CRCW0402-100K-E3; Supplier 3: Mouser; Value_Code: 100k; RoHS: E; Value1: 1%; MountType: SMT; Supplier 1: Digi-Key; PackageReference: 0402; Tolerance_%: 1%; Res_ohm: 100k; SizeArea_mm2: 0.5; CompType: Resistor; PartNumber: CRCW0402100KFKED; ComponentLink1Description: Datasheet link; Supplier Part Number 1: 541-100KLCT-ND; Technology: Thick Film; ComponentLink1URL: http://www.vishay.com/docs/20035/dcrcwe3.pdf
R139 = CMP-0026781-1: RES, 4.87 k, 0.1%, 0.062 W, AEC-Q200 Grade 0, 0402; Manufacturer: Panasonic; Power_W: 62mW; TempCo: 25 ppm/C; Value_Code: 4k87; U/M: EA; Value: 4.87k; EIA_Code: E192; SizeX_mm: 1; SizeY_mm: 0.5; SizeZ_mm: 0.6; Value2: 0.062W; AEC Qualified: Y; VDC_V: 25V; AEC Grade: 0; AEC Category: Q200; ComponentLink1URL: https://industrial.panasonic.com/cdbs/www-data/pdf/RDA0000/AOA0000C88.pdf; Supplier Part Number 2: 49W8878; Publisher: Texas Instruments; Supplier 2: Newark; Supplier Part Number 3: 667-ERA-2AEB4871X; Supplier 3: Mouser; Published: 2008-06-26; RoHS: Y; Value1: 0.1%; MountType: SMT; Supplier 1: Digi-Key; PackageReference: 0402; Tolerance_%: 0.1%; Res_ohm: 4.87k; SizeArea_mm2: 0.5; CompType: Resistor; LatestRevisionDate: 2017-03-09; PartNumber: ERA-2AEB4871X; ComponentLink1Description: Datasheet link; Supplier Part Number 1: P4.87KDCCT-ND; Technology: Thin Film
R141 = CMP-0026992-3: RES, 0, 5%, 0.1 W, AEC-Q200 Grade 0, 0402; Manufacturer: Panasonic; Power_W: 100mW; TempCo: 600 ppm/C; Value_Code: 0000; Value: 0; EIA_Code: E24; SizeX_mm: 1; SizeY_mm: 0.5; SizeZ_mm: 0.6; Value2: 0.1W; AEC Qualified: Y; VDC_V: 50V; AEC Category: Q200; SizeAreaWB_mm2: 3; Supplier Part Number 2: 65T8307; Supplier 2: Newark; Supplier Part Number 3: 667-ERJ-2GE0R00X; Supplier 3: Mouser; RoHS: Y; Value1: 5%; MountType: SMT; Supplier 1: Digi-Key; PackageReference: 0402; Tolerance_%: 5%; Res_ohm: 0; SizeArea_mm2: 0.5; CompType: Resistor; PartNumber: ERJ-2GE0R00X; ComponentLink1Description: Datasheet link; Supplier Part Number 1: P0.0JCT-ND; Technology: Thick Film; ComponentLink1URL: https://industrial.panasonic.com/cdbs/www-data/pdf/RDA0000/AOA0000C301.pdf; AEC Grade: 0
R142 R186 R190 = CMP-0026825-5: RES, 10 k, 5%, 0.063 W, AEC-Q200 Grade 0, 0402; Manufacturer: Vishay-Dale; Power_W: 63mW; TempCo: 200 ppm/C; Value_Code: 10k0; Value: 10k; EIA_Code: E24; SizeX_mm: 1; SizeY_mm: 0.5; SizeZ_mm: 0.6; Value2: 0.063W; AEC Qualified: Y; VDC_V: 50V; AEC Category: Q200; AEC Grade: 0; Supplier Part Number 2: 59M6696; Supplier 2: Newark; Supplier Part Number 3: 71-CRCW0402J-10K-E3; Supplier 3: Mouser; RoHS: E; Value1: 5%; MountType: SMT; Supplier 1: Digi-Key; PackageReference: 0402; Tolerance_%: 5%; Res_ohm: 10k; SizeArea_mm2: 0.5; CompType: Resistor; PartNumber: CRCW040210K0JNED; ComponentLink1Description: Datasheet link; Supplier Part Number 1: 541-10KJCT-ND; Technology: Thick Film; ComponentLink1URL: http://www.vishay.com/docs/20035/dcrcwe3.pdf
R145 = CMP-0083632-1: RES, 48.7 k, 0.1%, 0.063 W, AEC-Q200 Grade 0, 0402; Manufacturer: Panasonic; Power_W: 63mW; TempCo: 25 ppm/C; SizeAreaWB_mm2: 3; Value_Code: 48k7; Value: 48.7k; EIA_Code: E192; SizeX_mm: 1; SizeY_mm: 0.5; SizeZ_mm: 0.6; Value2: 0.063W; AEC Qualified: Y; VDC_V: 50V; AEC Grade: 0; AEC Category: Q200; ComponentLink1URL: https://industrial.panasonic.com/cdbs/www-data/pdf/RDM0000/AOA0000C307.pdf; Supplier Part Number 2: 667-ERA-2AEB4872X; Supplier 2: Mouser; RoHS: Y; Value1: 0.1%; MountType: SMT; Supplier 1: Digi-Key; PackageReference: 0402; Tolerance_%: 0.1%; Res_ohm: 48.7k; SizeArea_mm2: 0.5; CompType: Resistor; PartNumber: ERA-2AEB4872X; ComponentLink1Description: Datasheet link; Supplier Part Number 1: P48.7KDCCT-ND; Technology: Thin Film
R146 = CMP-0083657-1: RES, 4.42 k, 0.1%, 0.063 W, AEC-Q200 Grade 0, 0402; Manufacturer: Panasonic; Value_Code: 4k42; SizeAreaWB_mm2: 3; SizeArea_mm2: 0.5; AEC Qualified: Y; AEC Category: Q200; Value: 4.42k; SizeZ_mm: 0.6; EIA_Code: E192; TempCo: 10 ppm/C; AEC Grade: 0; Power_W: 63mW; Value2: 0.063W; SizeX_mm: 1; ComponentLink1Description: Datasheet link; RoHS: Y; Tolerance_%: 0.1%; Supplier 1: Digi-Key; PackageReference: 0402; Technology: Thin Film; Res_ohm: 4.42k; PartNumber: ERA-2ARB4421X; Supplier Part Number 2: 667-ERA-2ARB4421X; Supplier 2: Mouser; SizeY_mm: 0.5; ComponentLink1URL: https://industrial.panasonic.com/cdbs/www-data/pdf/RDM0000/AOA0000C307.pdf; Value1: 0.1%; CompType: Resistor; MountType: SMT; Supplier Part Number 1: P18066CT-ND
R147 = CMP-0026822-3: RES, 0, 5%, 0.063 W, AEC-Q200 Grade 0, 0402; Manufacturer: Vishay-Dale; Power_W: 63mW; TempCo: 200 ppm/C; Value_Code: 0000; Value: 0; EIA_Code: E24; SizeX_mm: 1; SizeY_mm: 0.5; SizeZ_mm: 0.6; Value2: 0.063W; AEC Qualified: Y; VDC_V: 50V; AEC Category: Q200; Supplier Part Number 2: 52K6543; Supplier 2: Newark; Supplier Part Number 3: 71-CRCW0402-0-E3; Supplier 3: Mouser; RoHS: E; Value1: 5%; MountType: SMT; Supplier 1: Digi-Key; PackageReference: 0402; Tolerance_%: 5%; Res_ohm: 0; SizeArea_mm2: 0.5; CompType: Resistor; PartNumber: CRCW04020000Z0ED; ComponentLink1Description: Datasheet link; Supplier Part Number 1: 541-0.0JCT-ND; Technology: Thick Film; ComponentLink1URL: http://www.vishay.com/docs/20035/dcrcwe3.pdf; AEC Grade: 0
R150 = CMP-0025951-3: RES, 100, 1%, 0.063 W, AEC-Q200 Grade 0, 0402; Manufacturer: Vishay-Dale; Power_W: 63mW; TempCo: 100 ppm/C; Value_Code: 100R; Value: 100; EIA_Code: E96; SizeX_mm: 1; SizeY_mm: 0.5; SizeZ_mm: 0.6; Value2: 0.063W; AEC Qualified: Y; VDC_V: 50V; AEC Category: Q200; AEC Grade: 0; Supplier Part Number 2: 52K6609; Supplier 2: Newark; Supplier Part Number 3: 71-CRCW0402-100-E3; Supplier 3: Mouser; RoHS: E; Value1: 1%; MountType: SMT; Supplier 1: Digi-Key; PackageReference: 0402; Tolerance_%: 1%; Res_ohm: 100; SizeArea_mm2: 0.5; CompType: Resistor; PartNumber: CRCW0402100RFKED; ComponentLink1Description: Datasheet link; Supplier Part Number 1: 541-100LCT-ND; Technology: Thick Film; ComponentLink1URL: http://www.vishay.com/docs/20035/dcrcwe3.pdf
R156 = CMP-0016044-3: RES, 0, 5%, 0.75 W, AEC-Q200 Grade 0, 2010; Manufacturer: Vishay-Dale; Power_W: 750mW; TempCo: ppm/C; Value_Code: 0000; Value: 0; EIA_Code: E24; SizeX_mm: 5; SizeY_mm: 2.5; SizeZ_mm: 1.66; Value2: 0.75W; SizeArea_mm2: 12.5; CompType: Resistor; AEC Qualified: Y; AEC Category: Q200; RoHS: E; Value1: 5%; MountType: SMT; Supplier 1: Digi-Key; PackageReference: 2010; Tolerance_%: 5%; Res_ohm: 0; PartNumber: CRCW20100000Z0EF; ComponentLink1Description: Datasheet link; AEC Grade: 0; Supplier Part Number 1: 541-0.0WCT-ND; Technology: Thick Film; ComponentLink1URL: http://www.vishay.com/docs/20035/dcrcwe3.pdf
R157 = CMP-0026822-3: RES, 0, 5%, 0.063 W, AEC-Q200 Grade 0, 0402; Manufacturer: Vishay-Dale; Power_W: 63mW; TempCo: 200 ppm/C; Value_Code: 0000; Value: 0; EIA_Code: E24; SizeX_mm: 1; SizeY_mm: 0.5; SizeZ_mm: 0.6; Value2: 0.063W; CompType: Resistor; AEC Qualified: Y; VDC_V: 50V; AEC Category: Q200; Supplier Part Number 2: 52K6543; Supplier 2: Newark; Supplier Part Number 3: 71-CRCW0402-0-E3; Supplier 3: Mouser; RoHS: E; Value1: 5%; MountType: SMT; Supplier 1: Digi-Key; PackageReference: 0402; Tolerance_%: 5%; Res_ohm: 0; SizeArea_mm2: 0.5; PartNumber: CRCW04020000Z0ED; ComponentLink1Description: Datasheet link; Supplier Part Number 1: 541-0.0JCT-ND; Technology: Thick Film; ComponentLink1URL: http://www.vishay.com/docs/20035/dcrcwe3.pdf; AEC Grade: 0
R158 = CMP-0025958-3: RES, 10.0 k, 1%, 0.063 W, AEC-Q200 Grade 0, 0402; Manufacturer: Vishay-Dale; Power_W: 63mW; TempCo: 100 ppm/C; Value_Code: 10k0; Value: 10.0k; EIA_Code: E96; Res_ohm: 10k; SizeX_mm: 1; SizeY_mm: 0.5; SizeZ_mm: 0.6; Value2: 0.063W; AEC Qualified: Y; VDC_V: 50V; AEC Category: Q200; AEC Grade: 0; Supplier Part Number 2: 52K6595; Supplier 2: Newark; Supplier Part Number 3: 71-CRCW0402-10K-E3; Supplier 3: Mouser; RoHS: E; Value1: 1%; MountType: SMT; Supplier 1: Digi-Key; PackageReference: 0402; Tolerance_%: 1%; SizeArea_mm2: 0.5; CompType: Resistor; PartNumber: CRCW040210K0FKED; ComponentLink1Description: Datasheet link; Supplier Part Number 1: 541-10.0KLCT-ND; Technology: Thick Film; ComponentLink1URL: http://www.vishay.com/docs/20035/dcrcwe3.pdf
TP1 TP3 = CMP-0055138-1: Test Point, Miniature, Black, TH; Manufacturer: Keystone; CNHeader: FALSE; Green_Lifecycle: Active; Green_REACh: Passed; ContactFinish: Silver; CT: TRUE; ComponentLink1URL: http://www.keyelco.com/userAssets/file/M60-2p60.pdf; Supplier Part Number 2: 534-5001; Publisher: Texas Instruments; Supplier 2: Mouser; Color: Black; RoHS: Y; MountType: TH; Green_EU RoHS-2: Incomplete; Supplier 1: Digi-Key; Green_EU RoHS: Passed; PackageReference: Black Miniature Testpoint; CompType: Test Point; LatestRevisionDate: 26/05/2017; PartNumber: 5001; ComponentLink1Description: Datasheet URL; Supplier Part Number 1: 36-5001-ND
TP2 = CMP-0003719-1: Testpoint; Manufacturer: Texas Instruments; CompType: Pad; ComponentLink1URL: https://sps06.itg.ti.com/sites/KMS/crossdivteams/altium/docs/ComponentDatasheets/testpin with 750um Padsice and 450um drillhole.pdf; Key: TP_H0.45P0.75; Publisher: Texas Instruments; PackageReference: Test Point, 0.45mm hole size; LatestRevisionDate: 2017-03-09; MountType: TH; PartNumber: TP_H0.45P0.75; ComponentLink1Description: Datasheet Link
U4 = CMP-0078631-1: Boost and Dual Buck Regulators With Diagnostic Functions, RHB0032N (VQFN-32); Manufacturer: Texas Instruments; SizeArea_mm2: 25; SizeAreaWB_mm2: 49; SizeX_mm: 5; SizeZ_mm: 0.9; CompType: IC; AEC Category: Q200; AEC Qualified: Y; PartNumber: LP87702DRHBRQ1; PackageReference: RHB0032N; PackageDescription: VQFN-32; MountType: SMT; SizeY_mm: 5; ComponentLink1Description: Datasheet Link; ComponentLink1URL: https://sps16.itg.ti.com/sites/KMS/crossdivteams/altium/docs/ComponentDatasheets/LP8770-Q1_SNVSAL1%20internal%208Sept2017.pdf; Alternate Manufacturer: Texas Instruments; ComponentLink2Description: Product Folder; ComponentLink2URL: TBD
U5 = CMP-0077268-2: Automotive 3A High-Accuracy Low-Noise Low-Dropout (LDO) Voltage Regulator, RGR0020A (VQFN-20); Manufacturer: Texas Instruments; SizeAreaWB_mm2: 20.25; SizeZ_mm: 1.0; SizeX_mm: 3.5; SizeArea_mm2: 12.25; CompType: IC; AEC Qualified: Y; AEC Category: Q200; ComponentLink1URL: http://www.ti.com/lit/ds/symlink/tps7a53-q1.pdf; PackageDescription: VQFN-20; MountType: SMT; ComponentLink2URL: http://www.ti.com/product/tps7a53-q1; ComponentLink2Description: Product Folder; PackageReference: RGR0020A; SizeY_mm: 3.5; PartNumber: TPS7A5301QRGRRQ1; ComponentLink1Description: Datasheet Link; ComponentLink3Description: Online Datasheet; ComponentLink3URL: http://www.ti.com/product/tps7a53-q1/datasheet; RoHS: Y
U8 = CMP-0076346-4: 2.5A, 36 V Synchronous, 2.1MHz, Automotive Step Down DC-DC Converter, RNL0022A (VQFN-HR-22); PartNumber: LM536253QRNLRQ1; Alternate PartNumber: LM536253QRNLTQ1; Manufacturer: Texas Instruments; SizeArea_mm2: 20.0; SizeAreaWB_mm2: 42.0; SizeX_mm: 4.0; SizeY_mm: 5.0; SizeZ_mm: 0.9; CompType: IC; AEC Category: Q200; AEC Qualified: Y; PackageReference: RNL0022A; PackageDescription: VQFN-HR-22; MountType: SMT; ComponentLink1Description: Datasheet Link; ComponentLink1URL: http://www.ti.com/lit/ds/symlink/lm53625-q1.pdf; RoHS: Y; Alternate Manufacturer: Texas Instruments; ComponentLink2Description: Product Folder; ComponentLink2URL: http://www.ti.com/product/lm53625-q1; ComponentLink3Description: Online Datasheet; ComponentLink3URL: http://www.ti.com/product/lm53625-q1/datasheet; Operating Temprature Range: -40 to 150 C; Rating: Automotive